# EAGLE design power (EAGLE 6.5.0)
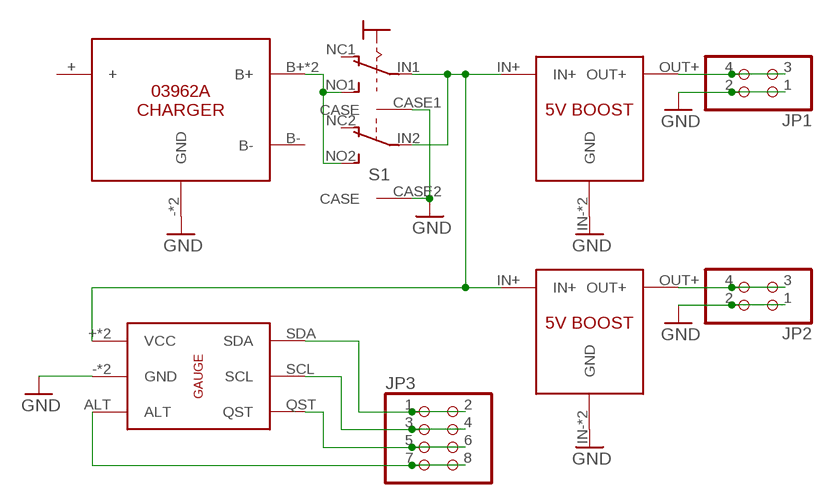
[diagram p0: schematic, sheet 1]

## Parts
JP1  PINHD-2X2/90  [2X02/90]
JP2  PINHD-2X2/90  [2X02/90]
JP3  PINHD-2X4/90  [2X04/90]
S1  PUSHSWITCH  [PUSHSWITCH]
U$1  03962A  [03962A]
U$2  5VBOOST  [5VBOOST]
U$3  5VBOOST  [5VBOOST]
U$4  GAUGE  [GAUGE]

## Nets
GND: JP1.1 JP1.2 JP2.1 JP2.2 S1.CASE1(1:CASE) S1.CASE2(B:CASE) U$1.-(GND) U$1.OUT-(GND) U$2.IN-(GND) U$2.OUT-(GND) U$3.IN-(GND) U$3.OUT-(GND) U$4.-(GND) U$4.GND
N$1: S1.NO1(1:NO) S1.NO2(B:NO) U$1.B+ U$1.OUT+(B+)
N$2: S1.IN1(1:IN) S1.IN2(B:IN) U$2.IN+ U$3.IN+ U$4.+(VCC) U$4.VCC
N$3: JP3.3 JP3.4 U$4.SCL
N$4: JP3.1 JP3.2 U$4.SDA
N$5: JP3.7 JP3.8 U$4.ALT
N$6: JP1.3 JP1.4 U$2.OUT+
N$9: JP2.3 JP2.4 U$3.OUT+
N$10: JP3.5 JP3.6 U$4.QST
Unconnected: S1.NC1(1:NC) S1.NC2(B:NC) U$1.+ U$1.B-

## Library data of the parts
JP1 JP2 = pinhead:PINHD-2X2: PIN HEADER
JP3 = pinhead:PINHD-2X4: PIN HEADER
S1 = lipo:PUSHSWITCH: TOGGLE SWITCH distributor RS Components
U$1 = lipo:03962A
U$2 U$3 = lipo:5VBOOST
U$4 = lipo:GAUGE

## Board
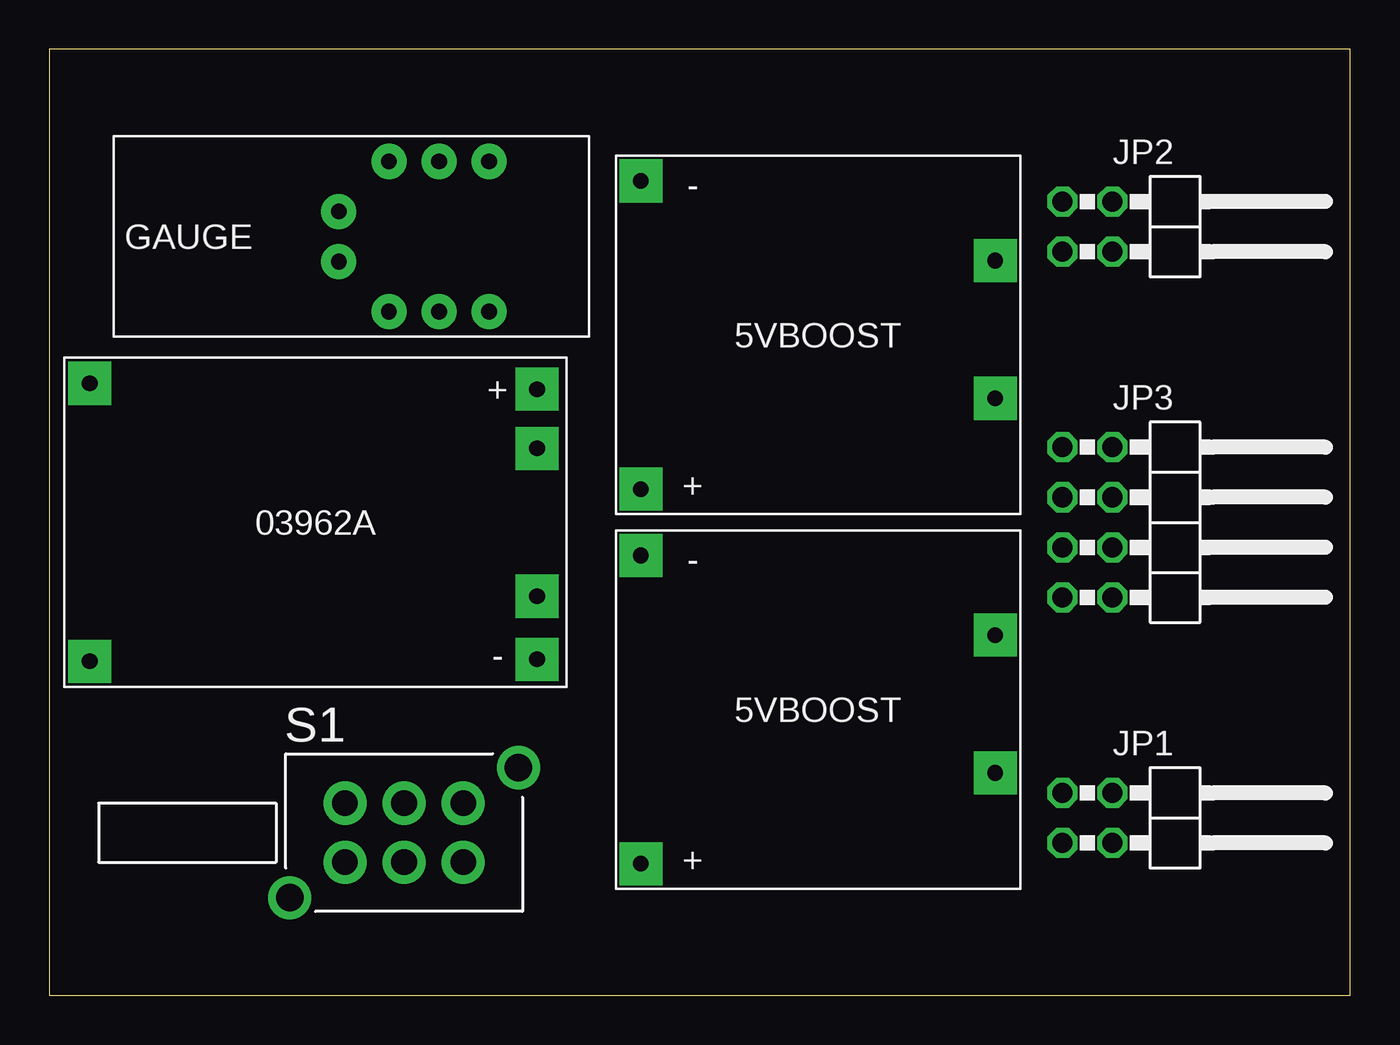
[diagram p1: board, top side]
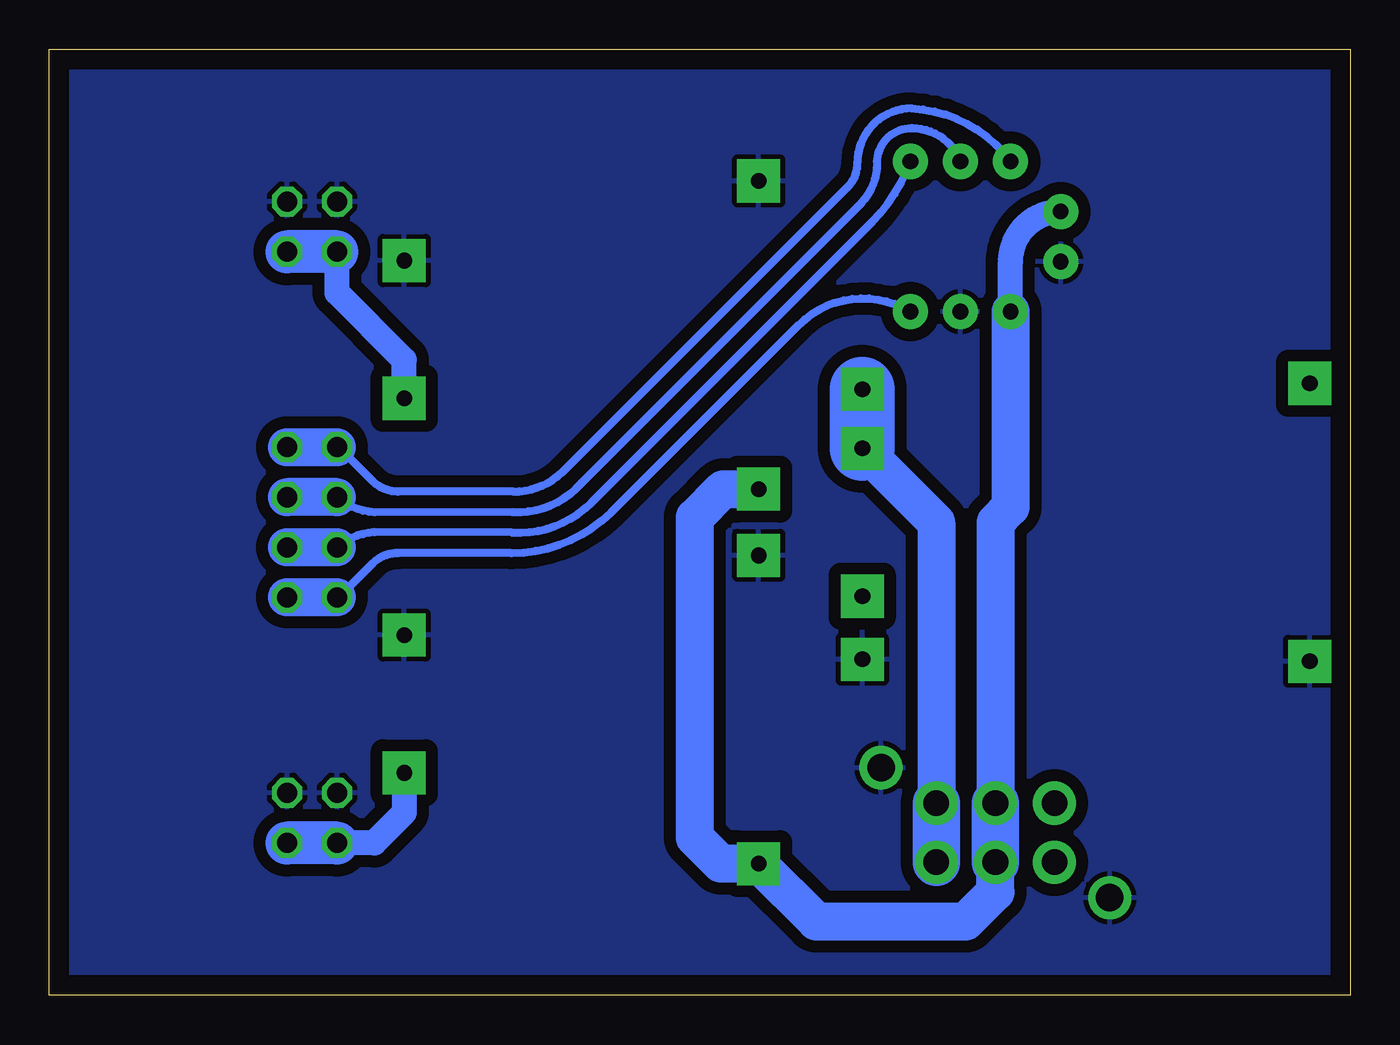
[diagram p2: board, bottom side, seen from below]

Size 66 x 48 mm. Coordinates in mm from the lower left corner, seen from the top.
Outline: 0,0 66,0 66,48 0,48 0,0
Copper layers (1*16): Top 0.035mm / dielectric 1.5mm / Bottom 0.035mm
Design rules "default": minimum track width 10mil, minimum drill 24mil, track to track 8mil, track to pad 8mil, pad to pad 8mil, via to via 8mil, smd to smd 8mil, copper to edge 40mil, drill to drill 8mil, minimum pad ring 10mil, minimum via ring 8mil, stop-mask expansion 4mil, vias tented up to drill 0mil, thermal gap 10mil

### Footprints (pad centres in the part's own frame; a part is rotated, then mirrored left to right if it is on the bottom)
2X02/90 = drill 1.016 octagon: 1 -1.27,-6.35; 2 -1.27,-3.81; 3 1.27,-6.35; 4 1.27,-3.81
2X04/90 = drill 1.016 octagon: 1 -3.81,-6.35; 2 -3.81,-3.81; 3 -1.27,-6.35; 4 -1.27,-3.81; 5 1.27,-6.35; 6 1.27,-3.81; 7 3.81,-6.35; 8 3.81,-3.81
PUSHSWITCH = drill 1.4 pad 2.184: CASE1 -5.8,-3.3; CASE2 5.8,3.3 | drill 1.3 pad 2.184: IN1 0,1.5; IN2 0,-1.5; NC1 -3,1.5; NC2 -3,-1.5; NO1 3,1.5; NO2 3,-1.5
03962A = drill 0.8 pad 2.184 square: + -11.45,7.05; - -11.45,-7.05; B+ 11.25,3.75; B- 11.25,-3.75; OUT+ 11.25,6.75; OUT- 11.25,-6.95
5VBOOST = drill 0.8 pad 2.184 square: IN+ 8.99,7.82; IN- 8.99,-7.82; OUT+ -8.99,3.21; OUT- -8.99,-3.775
GAUGE = drill 0.8 pad 1.778: + -3.81,1.27; - -3.81,-1.27; ALT 3.81,-3.81; GND 1.27,-3.81; QST 3.81,3.81; SCL 1.27,3.81; SDA -1.27,3.81; VCC -1.27,-3.81

### Placement (x,y rotation side)
JP1  57.75,9 270 top
JP2  57.75,39 270 top
JP3  57.75,24 270 top
S1  18,8.25 0 top
U$1  13.5,24 0 top
U$2  39,14.5 180 top
U$3  39,33.5 180 top
U$4  18.5,38.5 0 top

### Tracks (layer width: path | path; a pad name or v marks a point on that pad's centre or on a via)
GND
  pour Bottom (isolate 0.61): 0,48 66,48 66,0 0,0
N$1
  Bottom 1.93: U$1.B+ 21,24 S1.NO1
  Bottom 2.4: S1.NO2 S1.NO1
  Bottom 3.3: U$1.B+ U$1.OUT+
N$2
  Bottom 1.27: U$4.VCC 17.23,37.23 arc90 U$4.+
  Bottom 1.93: U$3.IN+ 31.82,25.68 33.25,24.25 33.25,8 31.93,6.68 U$2.IN+ 27.08,3.75 19.5,3.75 18,5.25 S1.IN2 | U$4.VCC 17.23,24.77 18,24 S1.IN1
  Bottom 2.4: S1.IN2 S1.IN1
N$3
  Bottom 0.406: JP3.3 arc-36 49.5,24.5 42.48,24.52 arc-53 39,26 25,40 arc-48 24,42.25 arc90 22.25,44 arc69 U$4.SCL
  Bottom 1.93: JP3.3 JP3.4
N$4
  Bottom 0.305: JP3.1 51.31,27.81
  Bottom 0.406: 51.31,27.81 49.56,26.06 arc-44 48.31,25.56 42.44,25.56 arc-42 40,26.5 25.5,41 arc-46 25,42.25 arc90 22.25,45 arc51 U$4.SDA
  Bottom 1.93: JP3.2 JP3.1
N$5
  Bottom 0.305: 51.31,20.19 JP3.7
  Bottom 0.406: 51.31,20.19 49.56,21.94 arc44 48.31,22.44 42.56,22.44 arc-44 37.5,24.5 28,34 arc76 U$4.ALT
  Bottom 1.93: JP3.7 JP3.8
N$6
  Bottom 1.27: U$2.OUT+ 47.99,9.26 49.52,7.73 JP1.3
  Bottom 2.184: JP1.3 JP1.4
N$9
  Bottom 1.27: JP2.3 51.4,35.65 47.99,32.24 U$3.OUT+
  Bottom 2.184: JP2.3 JP2.4
N$10
  Bottom 0.406: JP3.5 arc36 49.5,23.5 42.52,23.48 arc-48 38.5,25 24.25,39.25 arc-25 U$4.QST
  Bottom 1.93: JP3.5 JP3.6